# Altium schematic sheet Industrial-Controller_3.3V_Domain.SchDoc: DC/DC Step-Down Converter 3.3V
size 279 x 215 mm; Date: not used; ApprovedBy: not used; CheckedBy: not used; Author: not used; DrawnBy: not used; Organization: not used; Address4: not used; SheetNumber: 5; SheetTotal: 21; Time: not used; ImagePath: not used; Application_BuildNumber: not used
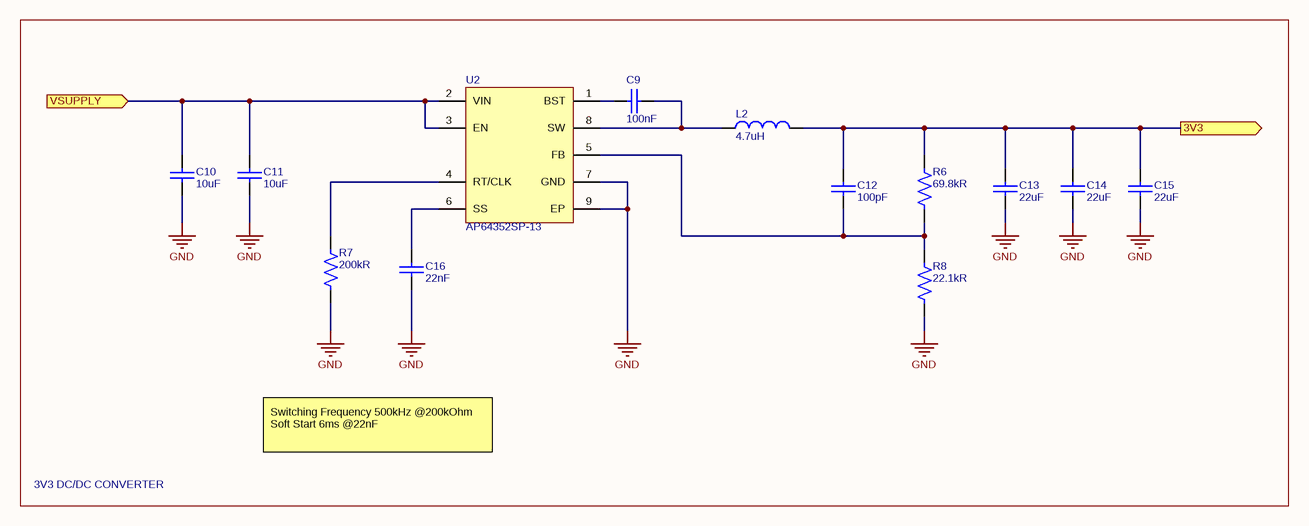
[diagram p0: Industrial-Controller_3.3V_Domain.SchDoc]

## Parts
C9  100nF  [CAP_0603]
C10  10uF  [CAP_1210]
C11  10uF  [CAP_1210]
C12  100pF  [CAP_0603]
C13  22uF  [CAP_1210]
C14  22uF  [CAP_1210]
C15  22uF  [CAP_1210]
C16  22nF  [CAP_0603]
L2  4.7uH  [SRU1048]
R6  69.8kR  [RES_0603]
R7  200kR  [RES_0603]
R8  22.1kR  [RES_0603]
U2  AP64352SP-13  [SOIC-8EP_150mil]

## Blocks framed on the sheet
3V3 DC/DC CONVERTER: C9-C16 L2 R6-R8 U2

## Ports
3V3 (out), VSUPPLY (in)

## Nets
GND: C10.1 C11.1 C13.1 C14.1 C15.1 C16.1 R7.2 R8.2 U2.7(GND) U2.9(EP)
3V3: C12.2 C13.2 C14.2 C15.2 L2.2 R6.1 ; port 3V3
VSUPPLY: C10.2 C11.2 U2.2(VIN) U2.3(EN) ; port VSUPPLY
NetC9_1: C9.1 L2.1 U2.8(SW)
NetC9_2: C9.2 U2.1(BST)
NetC12_1: C12.1 R6.2 R8.1 U2.5(FB)
NetC16_2: C16.2 U2.6(SS)
NetR7_1: R7.1 U2.4(RT/CLK)

## Notes on the sheet
- Switching Frequency 500kHz @200kOhm
  Soft Start 6ms @22nF
- Title:
- Date:
- Size A
- Project:
- Number:
- Time:
- Sheet
- Revision
- of
- Engineer:
- www.rft.com <http://www.rft.com>
- File:

## Library data of the parts
C9 = CL10B104KB8NNNL: CAP CER 0.1UF 50V X7R 0603; Manufacturer 1: Samsung; Tolerance: 10%; Supplier 1: Digi-Key; Manufacturer Part Number 1: CL10B104KB8NNNL; RoHS: Yes; Category: Ceramic Capacitors; Stock 1: 2348404; Pricing 1: 15000=0,00532, 30000=0,00506 (USD); Mount: Surface Mount; Case/Package: 0603; Min Operating Temperature: -55°C; Max Operating Temperature: 125°C; Capacitance: 100nF; Packaging: Tape and Reel; Package Quantity: 15000; Voltage Rating: 50V; Dielectric: X7R; Voltage Rating (DC): 50V; Series: CL; Construction: Flat; Length: 1.6mm; Width: 0.031inch; Height: 0.8mm; Thickness: 0.035inch; Depth: 0.8mm; Radiation Hardening: No; RoHS Compliant: Yes; ComponentLink1URL: https://datasheet.ciiva.com/26838/getdatasheetpartid-357523-26838415.pdf?src-supplier=Verical; ComponentLink1Description: https://datasheet.ciiva.com/26838/getdatasheetpartid-357523-26838415.pdf?src-supplier=Verical; ComponentLink2URL: https://datasheet.ciiva.com/25741/cl10b104kb8nnnl-25741341.pdf?src-supplier=Digi-Key; ComponentLink2Description: https://datasheet.ciiva.com/25741/cl10b104kb8nnnl-25741341.pdf?src-supplier=Digi-Key; Supplier Part Number 1: 1276-CL10B104KB8NNNLTR-ND
C10 C11 = CL32B106KBJNNWE: CAP CER 10UF 50V X7R 1210; Manufacturer 1: Samsung; Tolerance: 10%; Supplier 1: Digi-Key; Manufacturer Part Number 1: CL32B106KBJNNWE; RoHS: Yes; Category: Ceramic Capacitors; Stock 1: 395336; Pricing 1: 1=0,64000, 10=0,45500, 50=0,34380, 100=0,29940, 500=0,22176 (USD); Mount: Surface Mount; Case/Package: 1210; Case Code (Imperial): 1210; Case Code (Metric): 3225; Min Operating Temperature: -55°C; Max Operating Temperature: 125°C; Dielectric: X7R; Capacitance: 10uF; Voltage Rating: 50V; Package Quantity: 1; Packaging: Tape and Reel; Length: 0.126inch; Width: 0.098inch; Thickness: 0.106inch; Lead Free: Lead Free; ComponentLink1URL: https://datasheet.ciiva.com/25721/cl32b106kbjnnwe-25721651.pdf?src-supplier=Digi-Key; ComponentLink1Description: https://datasheet.ciiva.com/25721/cl32b106kbjnnwe-25721651.pdf?src-supplier=Digi-Key; Supplier Part Number 1: 1276-3388-1-ND
C12 = CL10B101KB8NFNC: CAP CER 100PF 50V X7R 0603; Manufacturer 1: Samsung; Tolerance: 10%; Supplier 1: Digi-Key; Manufacturer Part Number 1: CL10B101KB8NFNC; RoHS: Yes; Category: Ceramic Capacitors; Stock 1: 134085; Pricing 1: 1=0,10000, 10=0,04200, 50=0,02260, 100=0,01850, 500=0,01320, 1000=0,01038 (USD); Mount: Surface Mount; Case/Package: 0603; Case Code (Metric): 1608; Case Code (Imperial): 0603; Contact Plating: Tin; Min Operating Temperature: -55°C; Max Operating Temperature: 125°C; Package Quantity: 1; Packaging: Cut Tape; Capacitance: 100pF; Voltage Rating: 50V; Dielectric: X7R; Termination: Wraparound; Series: CL; Construction: Flat; Length: 0.063inch; Width: 0.031inch; Thickness: 0.035inch; RoHS Compliant: Yes; ComponentLink1URL: https://datasheet.ciiva.com/25739/cl10b101kb8nfnc-25739520.pdf?src-supplier=Digi-Key; ComponentLink1Description: https://datasheet.ciiva.com/25739/cl10b101kb8nfnc-25739520.pdf?src-supplier=Digi-Key; Supplier Part Number 1: 1276-1908-1-ND
C13-C15 = CL32B226KAJNNNE: CAP CER 22UF 25V X7R 1210; Manufacturer 1: Samsung; Material: Ceramic; Tolerance: 10%; Supplier 1: Digi-Key; Manufacturer Part Number 1: CL32B226KAJNNNE; RoHS: Yes; Category: Ceramic Capacitors; Stock 1: 784003; Pricing 1: 1=0,58000, 10=0,41000, 50=0,31000, 100=0,26990, 500=0,19996 (USD); Mount: Surface Mount; Case/Package: 1210; Case Code (Metric): 3225; Case Code (Imperial): 1210; Min Operating Temperature: -55°C; Max Operating Temperature: 125°C; Package Quantity: 1; Packaging: Tape and Reel; Capacitance: 22uF; Voltage Rating: 25V; Dielectric: X7R; Series: CL; Construction: Flat; Voltage Rating (DC): 25V; Length: 3.2mm; Width: 0.098inch; Height: 2.5mm; Thickness: 0.106inch; Depth: 2.5mm; Radiation Hardening: No; RoHS Compliant: Yes; Lead Free: Lead Free; ComponentLink1URL: https://datasheet.ciiva.com/25714/cl32b226kajnnne-25714610.pdf?src-supplier=Digi-Key; ComponentLink1Description: https://datasheet.ciiva.com/25714/cl32b226kajnnne-25714610.pdf?src-supplier=Digi-Key; Supplier Part Number 1: 1276-3392-1-ND
C16 = CL10B223KB8WPNC: CAP CER 0.022UF 50V X7R 0603; Manufacturer 1: Samsung; Tolerance: 10%; Supplier 1: Digi-Key; Manufacturer Part Number 1: CL10B223KB8WPNC; RoHS: Yes; Category: Ceramic Capacitors; Stock 1: 1346669; Pricing 1: 1=0,10000, 10=0,06000, 50=0,03260, 100=0,02660, 500=0,01902, 1000=0,01494 (USD); Mount: Surface Mount; Case/Package: 0603; Case Code (Metric): 1608; Case Code (Imperial): 0603; Min Operating Temperature: -55°C; Max Operating Temperature: 125°C; Capacitance: 22nF; Packaging: Tape and Reel; Voltage Rating: 50V; Features: Soft Termination; Length: 0.063inch; Width: 0.031inch; Thickness: 0.035inch; Ratings: AEC-Q200; RoHS Compliant: Yes; ComponentLink1URL: http://www.samsungsem.com/servlet/FileDownload?type=spec&file=CL10B223KB8WPNC.pdf&src-supplier=Avnet; ComponentLink1Description: http://www.samsungsem.com/servlet/FileDownload?type=spec&file=CL10B223KB8WPNC.pdf&src-supplier=Avnet; ComponentLink2URL: http://www.samsungsem.com/kr/support/product-search/mlcc/CL10B223KB8WPNC.jsp?src-supplier=Digi-Key; ComponentLink2Description: http://www.samsungsem.com/kr/support/product-search/mlcc/CL10B223KB8WPNC.jsp?src-supplier=Digi-Key; ComponentLink3URL: http://www.samsungsem.com/kr/support/library/product-catalog/mlcc.jsp?src-supplier=Digi-Key; ComponentLink3Description: http://www.samsungsem.com/kr/support/library/product-catalog/mlcc.jsp?src-supplier=Digi-Key; Supplier Part Number 1: 1276-6534-1-ND
L2 = SRU1048-4R7Y: FIXED IND 4.7UH 5.5A 9.5MOHM SMD; Manufacturer 1: Bourns; Core Material: Ferrite; Tolerance: 30%; DC Resistance (DCR): 9.5mR; Saturation Current: 4.75A; Shielding: Shielded; Self Resonant Frequency: 30MHz; Q Factor: 12; Test Frequency: 100kHz; Current: 1.1A; Supplier 1: Digi-Key; Manufacturer Part Number 1: SRU1048-4R7Y; RoHS: Yes; Category: Fixed Inductors; Stock 1: 8299; Pricing 1: 1=1,15000, 10=1,06400, 25=0,98200, 50=0,81840, 100=0,76930, 250=0,68744 (USD); Mount: Surface Mount; Case/Package: Nonstandard; Number of Pins: 2; Min Operating Temperature: -40°C; Max Operating Temperature: 125°C; Inductance: 4.7uH; Max DC Current: 5.5A; Package Quantity: 600; Current Rating: 5.5A; Packaging: Tape and Reel; Resistor Type: Wirewound; Termination: SMD/SMT; DC Current: 5.5A; Length: 0.394inch; Width: 0.394inch; Height: 4.8mm; Height - Seated (Max): 0.201inch; Depth: 10.3mm; Military Standard: Not; ComponentLink1URL: https://datasheet.ciiva.com/3868/41849217s8818625n1506-3868202.pdf?src-supplier=Arrow+Electronics; ComponentLink1Description: https://datasheet.ciiva.com/3868/41849217s8818625n1506-3868202.pdf?src-supplier=Arrow+Electronics; ComponentLink2URL: https://datasheet.ciiva.com/6703/sru1048-6703831.pdf?src-supplier=Digi-Key; ComponentLink2Description: https://datasheet.ciiva.com/6703/sru1048-6703831.pdf?src-supplier=Digi-Key; ComponentLink3URL: https://datasheet.ciiva.com/48685/sru1048-48685366.pdf?src-supplier=Avnet; ComponentLink3Description: https://datasheet.ciiva.com/48685/sru1048-48685366.pdf?src-supplier=Avnet; Supplier Part Number 1: SRU1048-4R7YCT-ND
R6 = RC0603FR-0769K8L: RES 69.8K OHM 1% 1/10W 0603; Manufacturer 1: Yageo; Power Rating: 100mW; Temperature Coefficient: 100ppm/°C; Voltage Rating: 50V; Supplier 1: Digi-Key; Manufacturer Part Number 1: RC0603FR-0769K8L; RoHS: Yes; Category: Chip SMD Resistors; Stock 1: 116926; Pricing 1: 1=0,10000, 10=0,02400, 100=0,00970, 1000=0,00436, 2500=0,00378 (USD); Case/Package: 0603; Case Code (Imperial): 0603; Case Code (Metric): 1608; Size Code: 0603; Min Operating Temperature: -55°C; Max Operating Temperature: 155°C; Tolerance: 1%; Series: RC; Package Quantity: 1; Packaging: Tape and Reel; Resistance: 69.8kR; Termination: SMD/SMT; Resistor Type: Thick Film; Number of Terminations: 2; Max Power Dissipation: 100mW; Voltage Rating (DC): 50V; Features: Moisture Resistant; Construction: Rectangular; Length: 1.6mm; Width: 0.8mm; Height: 0.022inch; Depth: 0.8mm; RoHS Compliant: Yes; Military Standard: Not; Lead Free: Lead Free; ComponentLink1URL: https://datasheet.ciiva.com/15189/getdatasheetpartid-325194-15189804.pdf?src-supplier=Verical; ComponentLink1Description: https://datasheet.ciiva.com/15189/getdatasheetpartid-325194-15189804.pdf?src-supplier=Verical; ComponentLink2URL: https://datasheet.ciiva.com/2454/pyu-r-int-thick-7-2454229.pdf?src-supplier=Digi-Key; ComponentLink2Description: https://datasheet.ciiva.com/2454/pyu-r-int-thick-7-2454229.pdf?src-supplier=Digi-Key; ComponentLink3URL: https://datasheet.ciiva.com/2454/pyu-r-int-thick-7-2454230.pdf?src-supplier=Digi-Key; ComponentLink3Description: https://datasheet.ciiva.com/2454/pyu-r-int-thick-7-2454230.pdf?src-supplier=Digi-Key; ComponentLink4URL: https://datasheet.ciiva.com/2454/pyu-r-int-thick-7-2454228.pdf?src-supplier=Digi-Key; ComponentLink4Description: https://datasheet.ciiva.com/2454/pyu-r-int-thick-7-2454228.pdf?src-supplier=Digi-Key; Supplier Part Number 1: 311-69.8KHRCT-ND
R7 = RC0603FR-07200KL: RES 200K OHM 1% 1/10W 0603; Manufacturer 1: Yageo; Temperature Coefficient: 100ppm/°C; Voltage Rating (DC): 50V; Power Rating: 100mW; Supplier 1: Digi-Key; Manufacturer Part Number 1: RC0603FR-07200KL; RoHS: Yes; Category: Chip SMD Resistors; Stock 1: 693919; Pricing 1: 5000=0,00312 (USD); Case/Package: 0603; Number of Pins: 2; Case Code (Metric): 1608; Case Code (Imperial): 0603; Size Code: 0603; Min Operating Temperature: -55°C; Max Operating Temperature: 155°C; Resistance: 200kR; Tolerance: 1%; Packaging: Tape and Reel; Resistor Type: Thick Film; Voltage Rating: 50V; Package Quantity: 1; Number of Terminations: 2; Termination: SMD/SMT; Max Power Dissipation: 100mW; Features: Moisture Resistant; Series: RC; Resistance Tolerance: 1%; Construction: Rectangular; Length: 1.6mm; Width: 0.031inch; Height: 0.022inch; Depth: 0.8mm; Lead Free: Lead Free; REACH SVHC: No SVHC; Military Standard: Not; RoHS Compliant: Yes; ComponentLink1URL: https://datasheet.ciiva.com/2453/pyu-r-int-thick-7-2453959.pdf?src-supplier=Digi-Key; ComponentLink1Description: https://datasheet.ciiva.com/2453/pyu-r-int-thick-7-2453959.pdf?src-supplier=Digi-Key; ComponentLink2URL: https://datasheet.ciiva.com/2453/pyu-r-int-thick-7-2453960.pdf?src-supplier=Digi-Key; ComponentLink2Description: https://datasheet.ciiva.com/2453/pyu-r-int-thick-7-2453960.pdf?src-supplier=Digi-Key; ComponentLink3URL: https://datasheet.ciiva.com/2453/pyu-r-int-thick-7-2453958.pdf?src-supplier=Digi-Key; ComponentLink3Description: https://datasheet.ciiva.com/2453/pyu-r-int-thick-7-2453958.pdf?src-supplier=Digi-Key; Supplier Part Number 1: 311-200KHRTR-ND
R8 = RC0603FR-0722K1L: RES 22.1K OHM 1% 1/10W 0603; Manufacturer 1: Yageo; Power Rating: 100mW; Voltage Rating: 50V; Temperature Coefficient: 100ppm/°C; Supplier 1: Digi-Key; Manufacturer Part Number 1: RC0603FR-0722K1L; RoHS: Yes; Category: Chip SMD Resistors; Stock 1: 845327; Pricing 1: 1=0,10000, 10=0,02400, 100=0,00970, 1000=0,00436, 2500=0,00378 (USD); Case/Package: 0603; Case Code (Imperial): 0603; Case Code (Metric): 1608; Size Code: 0603; Min Operating Temperature: -55°C; Max Operating Temperature: 155°C; Tolerance: 1%; Package Quantity: 5000; Packaging: Tape and Reel; Resistance: 22.1kR; Termination: SMD/SMT; Voltage Rating (DC): 50V; Series: RC; Length: 1.6mm; Width: 0.8mm; Height: 0.45mm; Lead Free: Lead Free; RoHS Compliant: Yes; ComponentLink1URL: https://datasheet.ciiva.com/12555/rc0603-272842-12555287.pdf?src-supplier=Mouser; ComponentLink1Description: https://datasheet.ciiva.com/12555/rc0603-272842-12555287.pdf?src-supplier=Mouser; Supplier Part Number 1: 311-22.1KHRCT-ND
U2 = AP64352SP-13: IC DCDC CONV BUCK 3.5A SO-8EP; Manufacturer 1: Diodes; Supplier 1: Digi-Key; Manufacturer Part Number 1: AP64352SP-13; RoHS: Yes; Category: Voltage Regulators - Switching; Stock 1: 134; Pricing 1: 1=1,66000, 10=1,48100, 25=1,40560, 100=1,15460, 250=1,07932, 500=0,95382, 1000=0,75301 (USD); Supplier Part Number 1: 31-AP64352SP-13CT-ND